# Altium schematic sheet STM32F103RCT6_MCU_LAB.SchDoc
size B; SheetNumber: 1; SheetTotal: 8
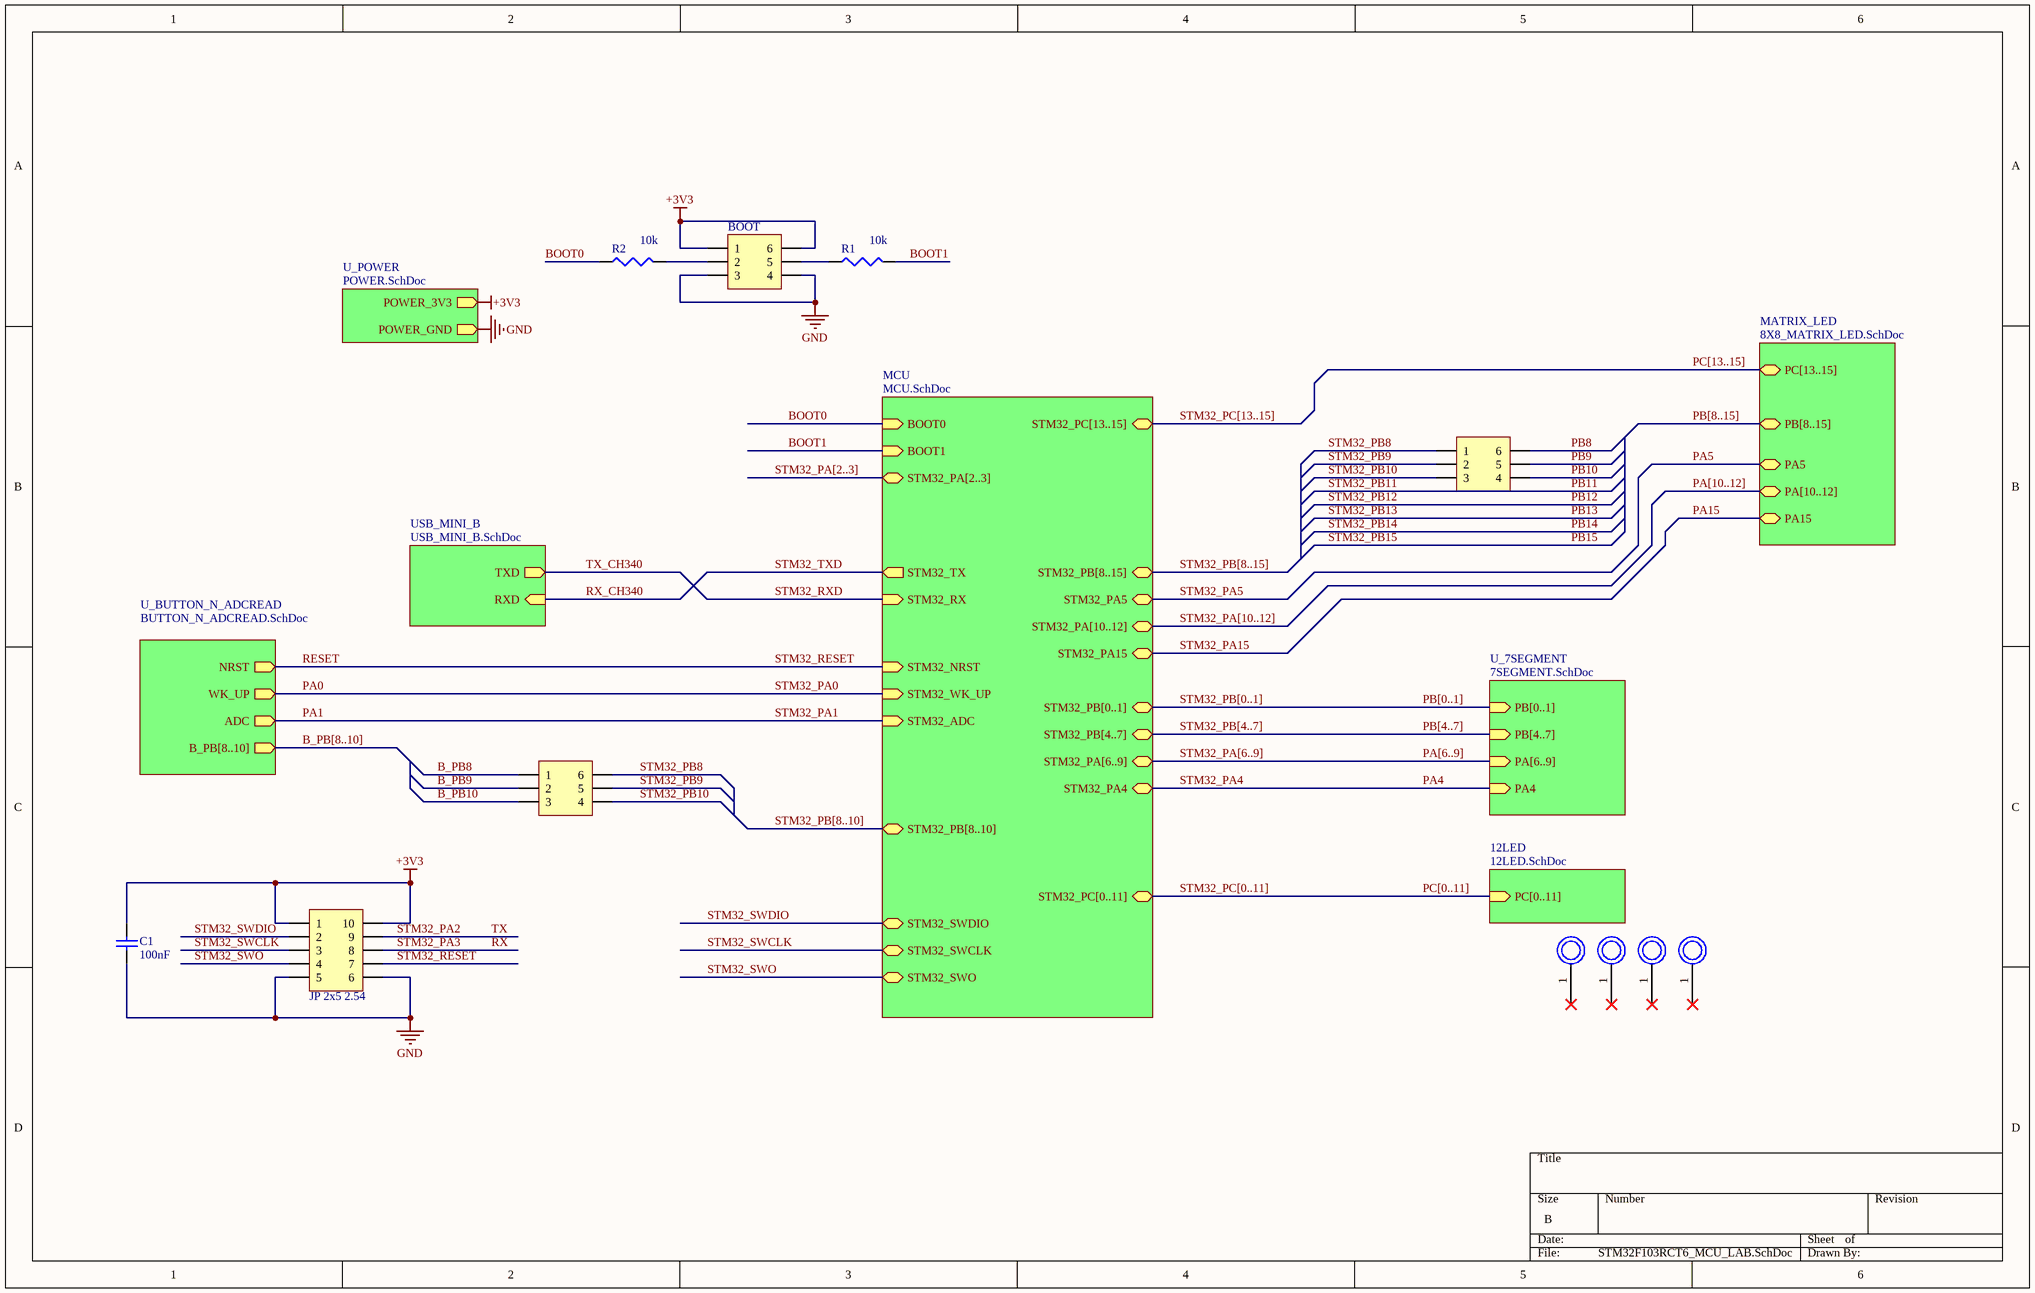
[diagram p0: STM32F103RCT6_MCU_LAB.SchDoc]

## Parts
BOOT  JP 2x3 2.54  [JP 2x3 DT]  (value not drawn)
C1  100nF  [CAPC0805(2012)145_L]
HOLE_M1  HOLE_M3  [HOLE M3]  (value not drawn)
HOLE_M2  HOLE_M3  [HOLE M3]  (value not drawn)
HOLE_M3  HOLE_M3  [HOLE M3]  (value not drawn)
HOLE_M4  HOLE_M3  [HOLE M3]  (value not drawn)
JP1  JP 2x3 2.54  [JP 2x3 DT]  (value not drawn)
JP2  JP 2x5 2.54  [JP 2x5 DT]
JP3  JP 2x3 2.54  [JP 2x3 DT]  (value not drawn)
R1  value 10k  [0805 (2012 Metric)]  (hidden comment: 1k)
R2  10k  [0805 (2012 Metric)]

## Sub-sheets
12LED = 12LED.SchDoc: PC[0..11] (in)
MATRIX_LED = 8X8_MATRIX_LED.SchDoc: PC[13..15] (bidir), PB[8..15] (bidir), PA5 (bidir), PA[10..12] (bidir), PA15 (bidir)
MCU = MCU.SchDoc: STM32_RX (in), STM32_TX (out), STM32_NRST (in), BOOT0 (in), STM32_PA[6..9] (bidir), STM32_PB[8..15] (bidir), STM32_WK_UP (in), STM32_PC[0..11] (bidir), STM32_ADC (in), STM32_PA5 (bidir), STM32_PB[4..7] (bidir), STM32_PA[2..3] (bidir), BOOT1 (in), STM32_PC[13..15] (bidir), STM32_PB[8..10] (bidir), STM32_SWDIO (bidir), STM32_SWCLK (bidir), STM32_PB[0..1] (bidir), STM32_PA[10..12] (bidir), STM32_PA15 (bidir), STM32_PA4 (bidir), STM32_SWO (bidir)
U_7SEGMENT = 7SEGMENT.SchDoc: PA[6..9] (in), PB[0..1] (in), PB[4..7] (in), PA4 (in)
U_BUTTON_N_ADCREAD = BUTTON_N_ADCREAD.SchDoc: B_PB[8..10] (out), NRST (out), WK_UP (out), ADC (out)
U_POWER = POWER.SchDoc: POWER_3V3 (out), POWER_GND (out)
USB_MINI_B = USB_MINI_B.SchDoc: TXD (out), RXD (in)

## Nets
+3V3: BOOT.1 BOOT.6 C1.2 JP2.1 JP2.10 ; sheet U_POWER/POWER_3V3
GND: BOOT.3 BOOT.4 C1.1 JP2.5 JP2.6 ; sheet U_POWER/POWER_GND
B_PB8: JP3.1
B_PB9: JP3.2
B_PB10: JP3.3
BOOT0: R2.1 ; sheet MCU/BOOT0
BOOT1: R1.2 ; sheet MCU/BOOT1
PA0: sheet MCU/STM32_WK_UP, sheet U_BUTTON_N_ADCREAD/WK_UP  [also labelled STM32_PA0]
PA1: sheet MCU/STM32_ADC, sheet U_BUTTON_N_ADCREAD/ADC  [also labelled STM32_PA1]
PA4: sheet MCU/STM32_PA4, sheet U_7SEGMENT/PA4  [also labelled STM32_PA4]
PA5: sheet MCU/STM32_PA5, sheet MATRIX_LED/PA5  [also labelled STM32_PA5]
PA15: sheet MCU/STM32_PA15, sheet MATRIX_LED/PA15  [also labelled STM32_PA15]
PB8: JP1.6
PB9: JP1.5
PB10: JP1.4
RESET: JP2.7 ; sheet MCU/STM32_NRST, sheet U_BUTTON_N_ADCREAD/NRST  [also labelled STM32_RESET]
RX: JP2.8  [also labelled STM32_PA3]
RX_CH340: sheet MCU/STM32_TX, sheet USB_MINI_B/RXD  [also labelled STM32_TXD]
STM32_PA2: JP2.9  [also labelled TX]
STM32_PB8: JP1.1 JP3.6
STM32_PB9: JP1.2 JP3.5
STM32_PB10: JP1.3 JP3.4
STM32_RXD: sheet MCU/STM32_RX, sheet USB_MINI_B/TXD  [also labelled TX_CH340]
STM32_SWCLK: JP2.3 ; sheet MCU/STM32_SWCLK
STM32_SWDIO: JP2.2 ; sheet MCU/STM32_SWDIO
STM32_SWO: JP2.4 ; sheet MCU/STM32_SWO
NetBOOT_2: BOOT.2 R2.2
NetBOOT_5: BOOT.5 R1.1

Not connected (* = marked no-connect by the designer): HOLE_M1 1*; HOLE_M2 1*; HOLE_M3 1*; HOLE_M4 1*

## Buses and harness runs
bus B_PB[8..10] = sheet U_BUTTON_N_ADCREAD/B_PB[8..10]
bus PA[6..9] = STM32_PA[6..9] = sheet MCU/STM32_PA[6..9] = sheet U_7SEGMENT/PA[6..9]
bus PA[10..12] = STM32_PA[10..12] = sheet MATRIX_LED/PA[10..12] = sheet MCU/STM32_PA[10..12]
bus PB[0..1] = STM32_PB[0..1] = sheet MCU/STM32_PB[0..1] = sheet U_7SEGMENT/PB[0..1]
bus PB[4..7] = STM32_PB[4..7] = sheet MCU/STM32_PB[4..7] = sheet U_7SEGMENT/PB[4..7]
bus PB[8..15] = sheet MATRIX_LED/PB[8..15]
bus PC[0..11] = STM32_PC[0..11] = sheet 12LED/PC[0..11] = sheet MCU/STM32_PC[0..11]
bus PC[13..15] = STM32_PC[13..15] = sheet MATRIX_LED/PC[13..15] = sheet MCU/STM32_PC[13..15]
bus STM32_PA[2..3] = sheet MCU/STM32_PA[2..3]
bus STM32_PB[8..10] = sheet MCU/STM32_PB[8..10]
bus STM32_PB[8..15] = sheet MCU/STM32_PB[8..15]

## Library data of the parts
BOOT JP1 JP3 = JP 2x3 2.54 Duc Thang: Cắm; Ten_Linh_Kien: Jump Đôi Đực 2.54MM 2x40P Thẳng 11MM; Don_Vi: Con; Ma_Hang: MH002686; Ghi_Chu: *; Kieu_Chan: *; Chung_Loai: Cắm
C1 = CMP-001-00081-5: Chip Capacitor, 100nF +/-40%, 16V, 0805, Thickness 1.45 mm; Tolerance: 5%; Min Operating Temperature: -55°C; Case/Package: 0805; Pins: 2; Max Operating Temperature: 85°C; Voltage Rating: 16V; Mounting Technology: SMT; Value: 100nF
HOLE_M1-HOLE_M4 = CMP-012-000000-2: Source: HOLE_M3.SchLib; Design Item ID: HOLE_M3
JP2 = JP 2x5 2.54 Duc Thang: Cắm; Ten_Linh_Kien: Jump Đôi Đực 2.54MM 2x40P Thẳng 11MM; Don_Vi: Con; Ma_Hang: MH002686; Ghi_Chu: *; Kieu_Chan: *; Chung_Loai: Cắm
R1 R2 = CMP-009-00179-13: Oreki; ComponentLink1Description: DigiKey; RoHS Compliant: Yes; Mounting Technology: SMT; Pins: 2; Case/Package: Chip
  R2: Value: 10k